# EAGLE schematic Thetis_RevD2_SCH (EAGLE 9.7.0)
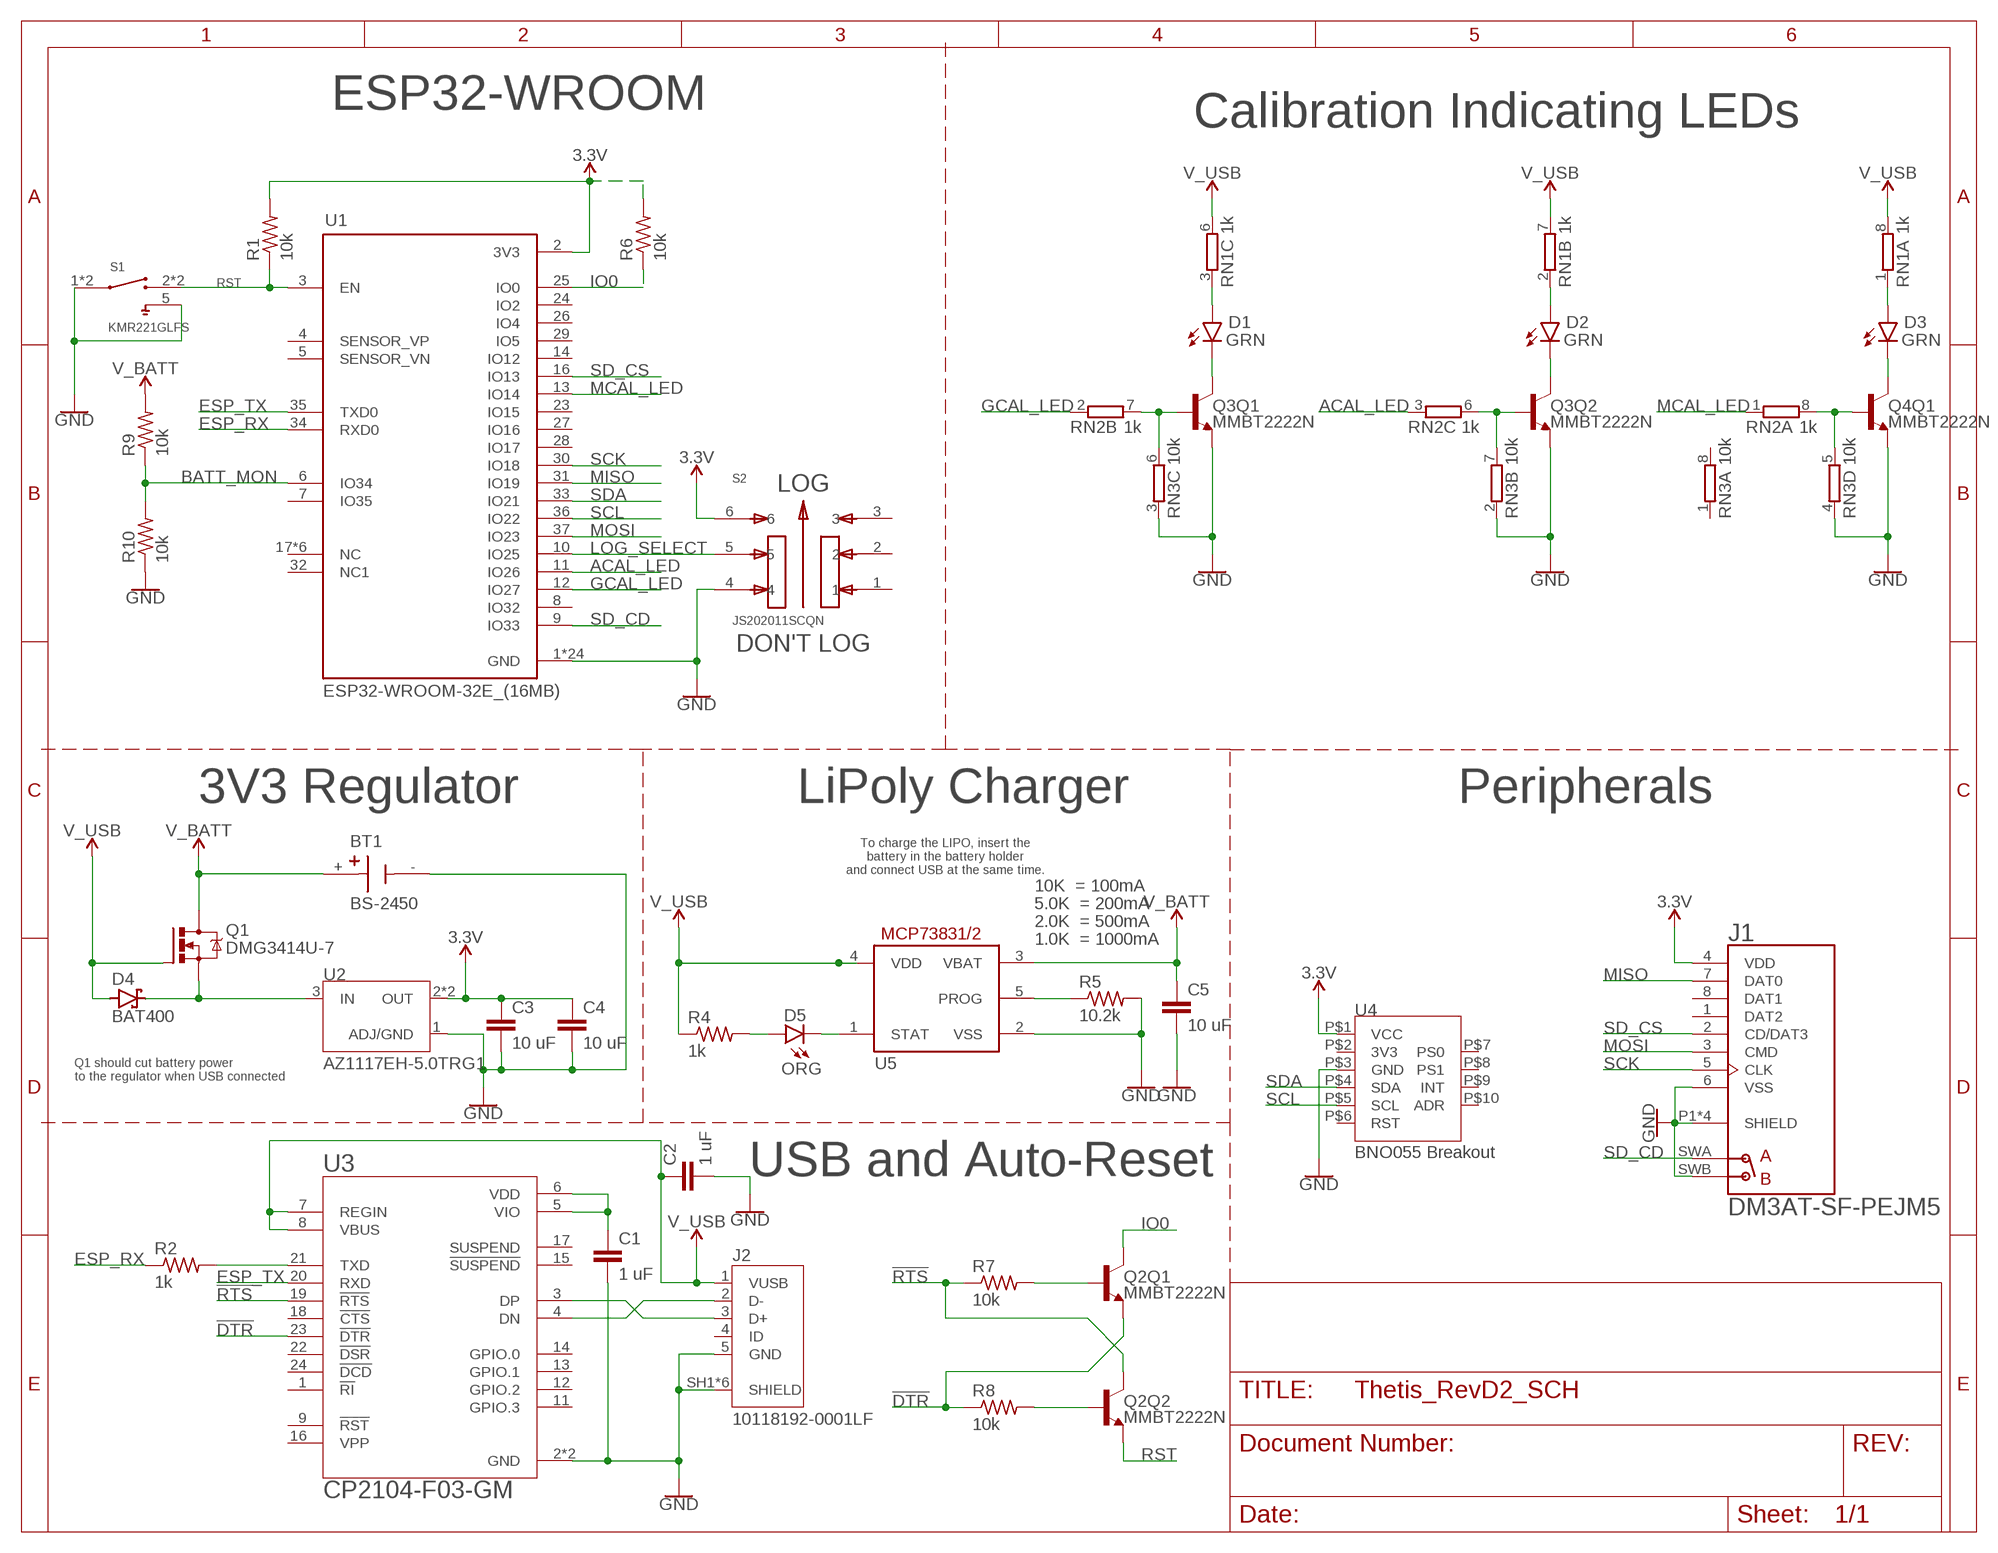
[diagram p0: schematic, sheet 1]

## Parts
BT1  BS-2450  [BAT_BS-2450]
C1  1 uF  C-EUC0603  [C0603]
C2  1 uF  C-EUC0603  [C0603]
C3  10 uF  C-EUC0603  [C0603]
C4  10 uF  C-EUC0603  [C0603]
C5  10 uF  C-EUC0603  [C0603]
D1  GRN  CHIP-ROUND-G_0603  [LEDC1608X65N]
D2  GRN  CHIP-ROUND-G_0603  [LEDC1608X65N]
D3  GRN  CHIP-ROUND-G_0603  [LEDC1608X65N]
D4  BAT400  BAS40  [SOT23]
D5  ORG  CHIP-ROUND-G_0603  [LEDC1608X65N]
J1  DM3AT-SF-PEJM5  [HRS_DM3AT-SF-PEJM5]
J2  10118192-0001LF  [AMPHENOL_10118192-0001LF]
Q1  DMG3414U-7  NMOSFETSOT23  [SOT23]
Q2  MMBT2222N  TRANS_NPN_DUAL-MBT3904DW1T1  [SC70-6]
Q3  MMBT2222N  TRANS_NPN_DUAL-MBT3904DW1T1  [SC70-6]
Q4  MMBT2222N  TRANS_NPN_DUAL-MBT3904DW1T1  [SC70-6]
R1  10k  R-US_R0603  [R0603]
R2  1k  R-US_R0603  [R0603]
R4  1k  R-US_R0603  [R0603]
R5  10.2k  R-US_R0603  [R0603]
R6  10k  R-US_R0603  [R0603]
R7  10k  R-US_R0603  [R0603]
R8  10k  R-US_R0603  [R0603]
R9  10k  R-US_R0603  [R0603]
R10  10k  R-US_R0603  [R0603]
RN1  1k  4R-NEXB28V  [EXB28V]
RN2  1k  4R-NEXB28V  [EXB28V]
RN3  10k  4R-NEXB28V  [EXB28V]
S1  KMR221GLFS  [SW_KMR221GLFS]
S2  JS202011SCQN  [SW_JS202011SCQN]
U1  ESP32-WROOM-32E_(16MB)  [MODULE_ESP32-WROOM-32E_(16MB)]
U2  AZ1117EH-5.0TRG1  [SOT230P700X180-4N]
U3  CP2104-F03-GM  [QFN50P400X400X80-25N]
U4  BNO055 Breakout  ADAFRUIT-BNO055-BREAKOUT-SMD  [ADAFRUIT-BNO055-BREAKOUT-SMD]
U5  MCP73831/OT  [SOT23-5L]

## Nets
3.3V: C3.1 C4.1 J1.4(VDD) R1.2 R6.2 S2.6 U1.2(3V3) U2.2(OUT) U2.4(OUT) U4.P$1(VCC)
!DTR: Q2.4(Q1:E) R8.1 U3.23(!DTR)
!RTS: Q2.6(Q2:C) R7.1 U3.19(!RTS)
ACAL_LED: RN2.3 U1.11(IO26)
BATT_MON: R9.1 R10.2 U1.6(IO34)
ESP_RX: R2.1 U1.34(RXD0)
ESP_TX: U1.35(TXD0) U3.20(RXD)
GCAL_LED: RN2.2 U1.12(IO27)
GND: BT1.- C1.2 C2.2 C3.2 C4.2 C5.2 J1.6(VSS) J1.P1(SHIELD) J1.P2(SHIELD) J1.P3(SHIELD) J1.P4(SHIELD) J1.SWB(B) J2.5(GND) J2.SH1(SHIELD) J2.SH2(SHIELD) J2.SH3(SHIELD) J2.SH4(SHIELD) J2.SH5(SHIELD) J2.SH6(SHIELD) Q3.1(Q2:E) Q3.4(Q1:E) Q4.4(Q1:E) R5.2 R10.1 RN3.2 RN3.3 RN3.4 S1.1 S1.4 S1.5 S2.4 U1.1(GND) U1.15(GND) U1.38(GND) U1.39_1(GND) U1.39_2(GND) U1.39_3(GND) U1.39_4(GND) U1.39_5(GND) U1.39_6(GND) U1.39_7(GND) U1.39_8(GND) U1.39_9(GND) U1.39_10(GND) U1.39_11(GND) U1.39_12(GND) U1.39_13(GND) U1.39_14(GND) U1.39_15(GND) U1.39_16(GND) U1.39_17(GND) U1.39_18(GND) U1.39_19(GND) U1.39_20(GND) U1.39_21(GND) U2.1(ADJ/GND) U3.2(GND) U3.25(GND) U4.P$3(GND) U5.2(VSS)
IO0: Q2.3(Q1:C) R6.1 U1.25(IO0)
LOG_SELECT: S2.5 U1.10(IO25)
MCAL_LED: RN2.1 U1.13(IO14)
MISO: J1.7(DAT0) U1.31(IO19)
MOSI: J1.3(CMD) U1.37(IO23)
N$2: C1.1 U3.5(VIO) U3.6(VDD)
N$3: R2.2 U3.21(TXD)
N$4: J2.3(D+) U3.3(DP)
N$5: J2.2(D-) U3.4(DN)
N$6: Q3.5(Q1:B) RN2.7 RN3.6
N$7: Q2.2(Q2:B) R8.2
N$8: D1.C Q3.3(Q1:C)
N$9: Q2.5(Q1:B) R7.2
N$10: D1.A RN1.3
N$11: D2.A RN1.2
N$12: D2.C Q3.6(Q2:C)
N$13: D4.3(C) Q1.2(S) U2.3(IN)
N$14: Q3.2(Q2:B) RN2.6 RN3.7
N$15: Q4.5(Q1:B) RN2.8 RN3.5
N$16: D3.C Q4.3(Q1:C)
N$17: D3.A RN1.1
N$20: D5.A R4.2
N$21: D5.C U5.1(STAT)
N$22: R5.1 U5.5(PROG)
RST: Q2.1(Q2:E) R1.1 S1.2 S1.3 U1.3(EN)
SCK: J1.5(CLK) U1.30(IO18)
SCL: U1.36(IO22) U4.P$5(SCL)
SD_CD: J1.SWA(A) U1.9(IO33)
SD_CS: J1.2(CD/DAT3) U1.16(IO13)
SDA: U1.33(IO21) U4.P$4(SDA)
V_BATT: BT1.+ C5.1 Q1.3(D) R9.2 U5.3(VBAT)
V_USB: C2.1 D4.1(A) J2.1(VUSB) Q1.1(G) R4.1 RN1.6 RN1.7 RN1.8 U3.7(REGIN) U3.8(VBUS) U5.4(VDD)
Unconnected: J1.1(DAT2) J1.8(DAT1) J2.4(ID) Q4.1(Q2:E) Q4.2(Q2:B) Q4.6(Q2:C) RN1.4 RN1.5 RN2.4 RN2.5 RN3.1 RN3.8 S2.1 S2.2 S2.3 U1.4(SENSOR_VP) U1.5(SENSOR_VN) U1.7(IO35) U1.8(IO32) U1.14(IO12) U1.17(NC) U1.18(NC) U1.19(NC) U1.20(NC) U1.21(NC) U1.22(NC) U1.23(IO15) U1.24(IO2) U1.26(IO4) U1.27(IO16) U1.28(IO17) U1.29(IO5) U1.32(NC1) U3.1(!RI) U3.9(!RST!) U3.11(GPIO.3) U3.12(GPIO.2) U3.13(GPIO.1) U3.14(GPIO.0) U3.15(!SUSPEND!) U3.16(VPP) U3.17(SUSPEND) U3.18(!CTS) U3.22(!DSR) U3.24(!DCD) U4.P$6(RST) U4.P$7(PS0) U4.P$8(PS1) U4.P$9(INT) U4.P$10(ADR)

## Notes on the sheet
- ESP32-WROOM
- Calibration Indicating LEDs
- LOG
- DON'T LOG
- 3V3 Regulator | LiPoly Charger | Peripherals
- To charge the LIPO, insert the
  battery in the battery holder
  and connect USB at the same time.
- 10K  = 100mA
- 5.0K  = 200mA
- 2.0K  = 500mA
- 1.0K  = 1000mA
- Q1 should cut battery power
  to the regulator when USB connected
- USB and Auto-Reset

## Power pins joined to a net without a drawn wire
3V3: U4.P$2(3V3)

## Library data of the parts
BT1 = BS-2450:BS-2450: Battery Holder (Open) Coin, 24.5mm 1 Cell PC Pin; AVAILABILITY: Unavailable; DESCRIPTION: Battery Holder _Open_ Coin, 24.5mm 1 Cell PC Pin; MF: MPD; MP: BS-2450; PACKAGE: Non-Standard MPD; PRICE: None
C1-C5 = rcl:C-EU: CAPACITOR, European symbol; SPICEPREFIX: C
D1-D3 D5 = LED:CHIP-ROUND-G; CATEGORY: LED; COLOR: GREEN; DESCRIPTION: CHIP LED ROUND; SUB-CATEGORY: CHIP; TYPE: ROUND_TOP
D4 = diode:BAS40: Silicon Schottky Diodes General-purpose diode for high-speed switching
J1 = DM3AT-SF-PEJM5:DM3AT-SF-PEJM5: DM3 Series 8 Position Right Angle SMT Push Push Ejection MicroSD Card Connector; AVAILABILITY: Unavailable; DESCRIPTION: DM3 RA SMT microSD memory card push/push; MF: Hirose; MP: DM3AT-SF-PEJM5; PACKAGE: None; PRICE: None
J2 = MicroUSB:10118192-0001LF: Single Port 5 Contact Horizontal Right Angle Shielded Micro B USB 2.0 Connector; MANUFACTURER: Amphenol; PARTREV: B; STANDARD: Manufacturer Recommendation
Q1 = Transistor:NMOSFET: N-Channel MOSFET - Generic; CATEGORY: Transistor; SUB-CATEGORY: MOSFET; TYPE: N-Channel; VALUE: NMOSFET
Q2-Q4 = SparkFun-DiscreteSemi-Poseidon-Edit:TRANS_NPN_DUAL: Dual NPN Transistors in Single Package The MBT3904W1 puts two general purpose 3904 NPN transistors in a single package. Datasheet <http://www.onsemi.com/pub_link/Collateral/MBT3904DW1T1-D.PDF> SparkFun Products: SparkFun ESP32 Thing <https://www.sparkfun.com/products/13907>; PROD_ID: TRANS-13337
R1 R2 R4-R10 = rcl:R-US_: RESISTOR, American symbol; SPICEPREFIX: R
RN1-RN3 = resistor-dil-Poseidon-Edit:4R-N: Array Chip Resistor Source: RS Component / Phycomp; OC_FARNELL: unknown; OC_NEWARK: unknown
S1 = KMR221GLFS:KMR221GLFS: Switch Tactile N.O. SPST Button Gull Wing 0.05A 32VDC 1VA 200000Cycles 2N SMD Automotive T/R; MANUFACTURER: CnK
S2 = JS202011SCQN:JS202011SCQN: JS Series DPDT On-On Gull Wing Surface Mount Subminiature Slide Switch; MANUFACTURER: C&K
U1 = ESP32-WROOM-32E:ESP32-WROOM-32E_(16MB): Bluetooth, WiFi 802.11b/g/n, Bluetooth v4.2 +EDR, Class 1, 2 and 3 Transceiver Module 2.4GHz ~ 2.5GHz Integrated, Trace Surface Mount; MANUFACTURER: Espressif Systems; MAXIMUM_PACKAGE_HEIGHT: 3.25mm; PARTREV: 1.1; STANDARD: Manufacturer Recommendations
U2 = AZ1117EH-5.0TRG1:AZ1117EH-5.0TRG1; ARROW_ELECTRONICS-PURCHASE-URL: https://snapeda.com/shop?store=Arrow+Electronics&id=482930; AVAILABILITY: Good; DESCRIPTION: Linear Voltage Regulator IC 1 Output 1A SOT-223; DIGIKEY-PURCHASE-URL: https://snapeda.com/shop?store=DigiKey&id=482930; MF: Diodes Inc.; MOUSER-PURCHASE-URL: https://snapeda.com/shop?store=Mouser&id=482930; MP: AZ1117EH-5.0TRG1; PACKAGE: SOT-223 Diodes Inc.; PRICE: None
U3 = CP2104:CP2104: Silabs CP2104 USB to UART Bridge; MANUFACTORER: Silicon Labs; PARTREV: 1.0; STANDERD: IPC-7351B
U4 = EVE-ECAD-Library:ADAFRUIT-BNO055-BREAKOUT
U5 = adafruit - EVE Edit:MCP73831: MCP73831/2 Miniature Single-Cell, Fully Integrated Li-Ion, Li-Polymer Charge Management Controllers. Nice and small simple lipoly charge controller, with adjustable current and status output (LED) http://www.ladyada.net/library/pcb/eaglelibrary.html

## Net classes
0 default: width 0.178 mm
2 lowpower: width 0.305 mm, drill 0.483 mm